# EAGLE design TouchPanelPrototype (EAGLE 6.3)
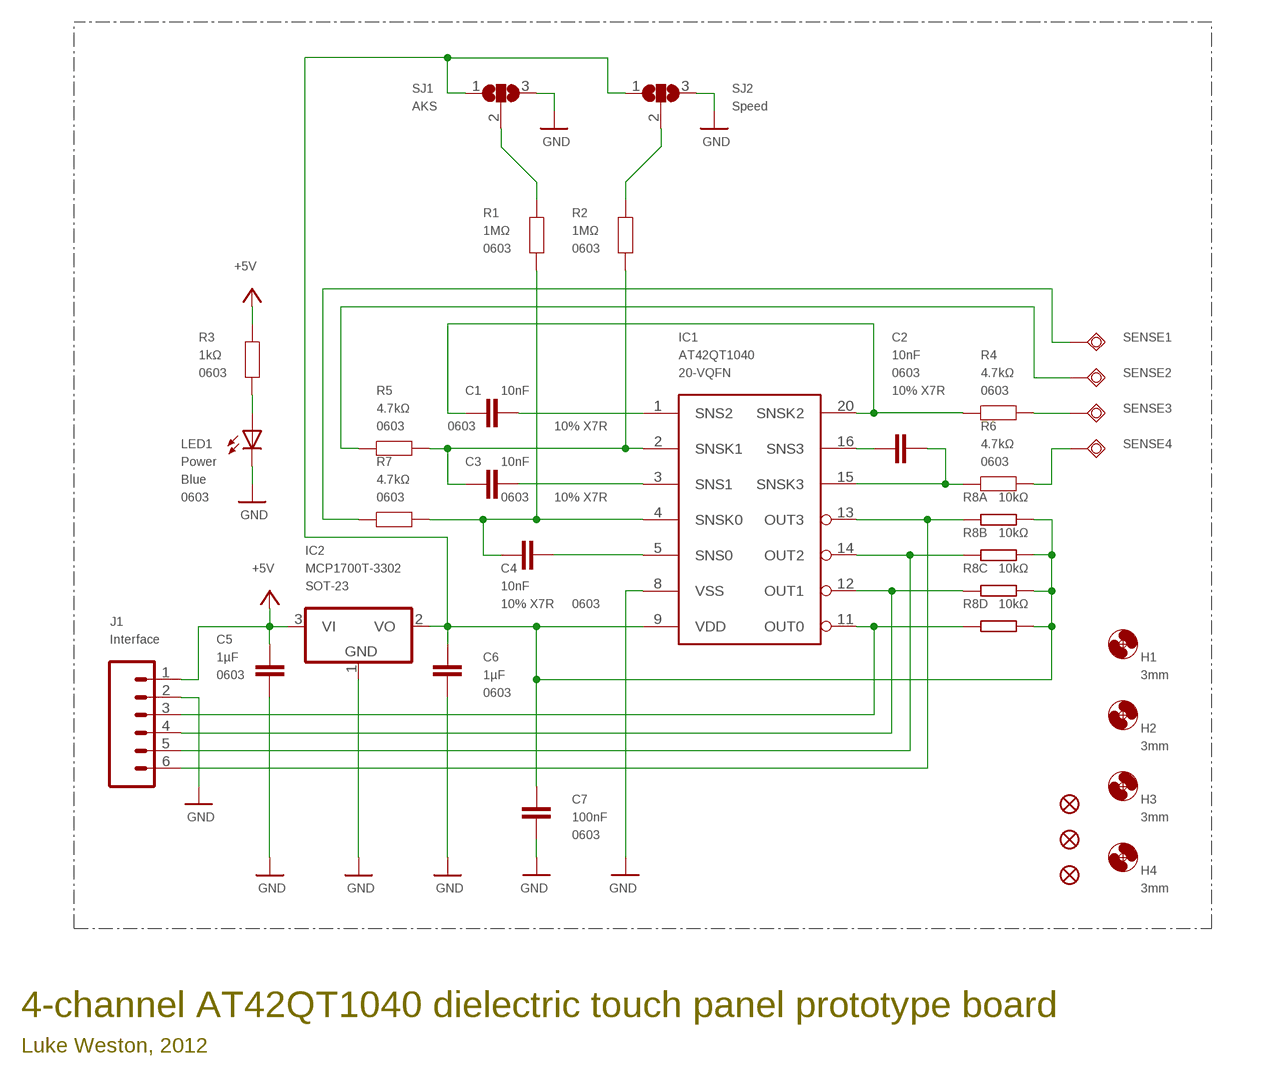
[diagram p0: schematic, sheet 1, part 1 of 2]
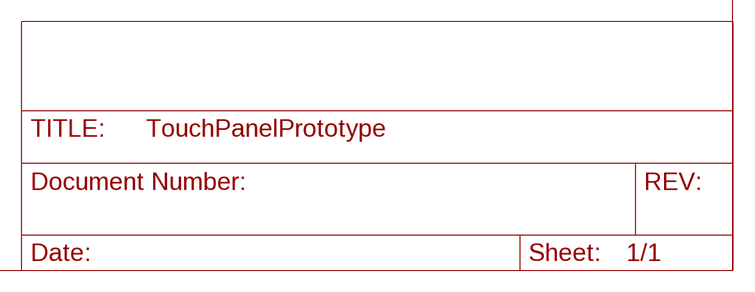
[diagram p1: schematic, sheet 1, part 2 of 2]

## Parts
C1  10nF  CAP0603  [0603]
C2  10nF  CAP0603  [0603]
C3  10nF  CAP0603  [0603]
C4  10nF  CAP0603  [0603]
C5  1µF  CAP0603  [0603]
C6  1µF  CAP0603  [0603]
C7  100nF  CAP0603  [0603]
H1  3mm  MOUNT-HOLE3.0  [3,0]
H2  3mm  MOUNT-HOLE3.0  [3,0]
H3  3mm  MOUNT-HOLE3.0  [3,0]
H4  3mm  MOUNT-HOLE3.0  [3,0]
IC1  AT42QT1040  [QFN/MLF20]
IC2  MCP1700T-3302  MCP1703CB  [SOT23]
J1  Interface  M06SIP  [1X06]
JP1  FIDUCIAL1X2  [FIDUCIAL-1X2]
JP2  FIDUCIAL1X2  [FIDUCIAL-1X2]
JP3  FIDUCIAL1X2  [FIDUCIAL-1X2]
LED1  Power  LED0603  [LED-0603]
R1  1MΩ  RESISTOR0603  [0603]
R2  1MΩ  RESISTOR0603  [0603]
R3  1kΩ  RESISTOR0603  [0603]
R4  4.7kΩ  RESISTOR0603  [0603]
R5  4.7kΩ  RESISTOR0603  [0603]
R6  4.7kΩ  RESISTOR0603  [0603]
R7  4.7kΩ  RESISTOR0603  [0603]
R8  10kΩ  CAY16  [CAY16]
SENSE1  TPSQTP20R  [TP20R]
SENSE2  TPSQTP20R  [TP20R]
SENSE3  TPSQTP20R  [TP20R]
SENSE4  TPSQTP20R  [TP20R]
SJ1  AKS  SJ2W  [SJ_2]
SJ2  Speed  SJ2W  [SJ_2]

## Nets
+5V: C5.2 IC2.3(VI) J1.1 R3.1
GND: C5.1 C6.1 C7.1 IC1.8(VSS) IC2.1(GND) J1.2 LED1.C SJ1.3 SJ2.3
N$1: LED1.A R3.2
N$3: C4.1 IC1.5(SNS0)
N$14: C2.2 IC1.16(SNS3)
N$15: C3.1 IC1.3(SNS1)
N$16: C1.1 IC1.1(SNS2)
N$17: C1.2 IC1.20(SNSK2) R4.2
N$19: C3.2 IC1.2(SNSK1) R2.2 R5.1
N$20: C4.2 IC1.4(SNSK0) R1.2 R7.1
N$25: C2.1 IC1.15(SNSK3) R6.2
N$30: R5.2 SENSE2.TP
N$31: R4.1 SENSE3.TP
N$32: R6.1 SENSE4.TP
N$34: R7.2 SENSE1.TP
N$40: R1.1 SJ1.2
N$41: R2.1 SJ2.2
N$43: C6.2 C7.2 IC1.9(VDD) IC2.2(VO) R8.1 R8.2 R8.3 R8.4 SJ1.1 SJ2.1
TOUCH1: IC1.11(OUT0) J1.3 R8.5
TOUCH2: IC1.12(OUT1) J1.4 R8.6
TOUCH3: IC1.14(OUT2) J1.5 R8.7
TOUCH4: IC1.13(OUT3) J1.6 R8.8

## Notes on the sheet
- 4-channel AT42QT1040 dielectric touch panel prototype board
- Luke Weston, 2012

## Library data of the parts
C1-C4 = freetronics-master-v1:CAP: Capacitor Standard 0603 ceramic capacitor, and 0.1" leaded capacitor.; INFO: 10% X7R; PACKAGE: 0603
C5-C7 = freetronics-master-v1:CAP: Capacitor Standard 0603 ceramic capacitor, and 0.1" leaded capacitor.; PACKAGE: 0603
H1-H4 = holes:MOUNT-HOLE: MOUNTING HOLE with drill center marker
IC1 = at42qt1040:AT42QT1040: QTouch 4-key Sensor IC ATMEL 20 pin 3x3 mm VQFN RoHS compliant AUTOR CICHOCKI ZBIGNIEW E-mile ontario4@wp.pl; PACKAGE: 20-VQFN
IC2 = linear:MCP1703: 250 mA, 16V, Low Quiescent Current LDO Regulator Source: http://ww1.microchip.com/downloads/en/DeviceDoc/22049b.pdf; PACKAGE: SOT-23
J1 = freetronics-master-v1:M06: Header 6 Standard 6-pin 0.1" header. Use with straight break away headers (SKU : PRT-00116), right angle break away headers (PRT-00553), swiss pins (PRT-00743), machine pins (PRT-00117), and female headers (PRT-00115). Molex polarized connector foot print use with SKU : PRT-08094 with associated crimp pins and housings. NOTES ON THE VARIANTS LOCK and LOCK_LONGPADS... This footprint was designed to help hold the alignment of a through-hole component (i.e. 6-pin header) while soldering it into place. You may notice that each hole has been shifted either up or down by 0.005 of an inch from it's more standard position (which is a perfectly straight line). This slight alteration caused the pins (the squares in the middle) to touch the edges of the holes. Because they are alternating, it causes a "brace" to hold the component in place. 0.005 has proven to be the perfect amount of "off-center" position when using our standard breakaway headers. Although looks a little odd when you look at the bare footprint, once you have a header in there, the alteration is very hard to notice. Also, if you push a header all the way into place, it is covered up entirely on the bottom side. This idea of altering the position of holes to aid alignment will be further integrated into the Sparkfun Library for other footprints. It can help hold any component with 3 or more connection pins.
JP1-JP3 = SparkFun:FIDUCIAL: Fiducial Alignment Points Various fiducial points for machine vision alignment.
LED1 = freetronics-master-v1:LED: LEDs Standard schematic elements and footprints for 5mm, 3mm, 1206, and 0603 sized LEDs. 5mm - Spark Fun Electronics SKU : COM-00529 (and others); COLOUR: Blue; PACKAGE: 0603
R1-R7 = freetronics-master-v1:RESISTOR: Resistor Basic schematic elements and footprints for 0603, 1206, and PTH 1/10th watt (small) resistors.; PACKAGE: 0603
R8 = freetronics-luke:CAY16
SENSE1-SENSE4 = testpad:TPSQ: Test pad
SJ1 SJ2 = jumper:SJ2W: SMD solder JUMPER

## Net classes
0 default: width 0.152 mm, drill 0.241 mm, clearance 0.152 mm

## Board
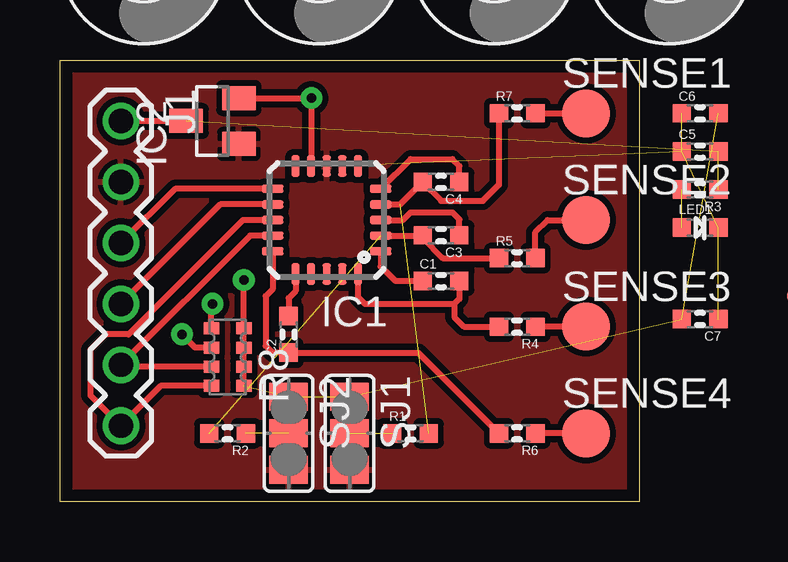
[diagram p2: board, top side]
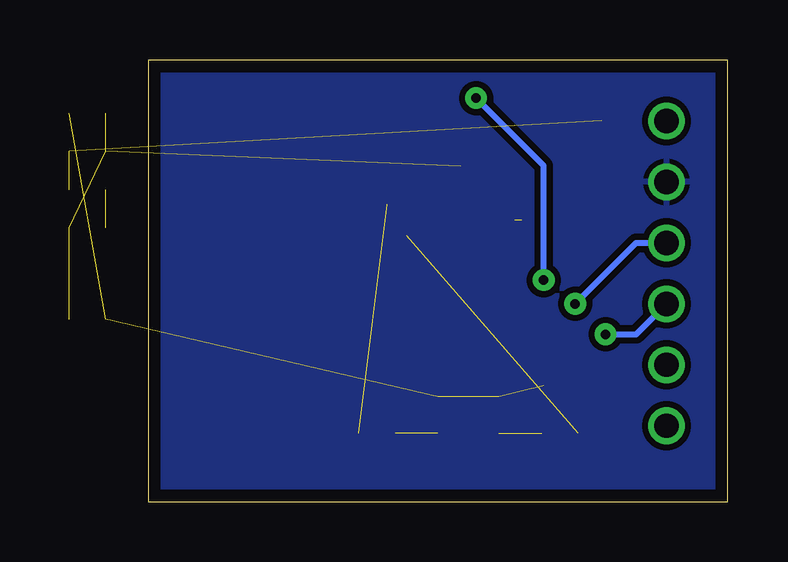
[diagram p3: board, bottom side, seen from below]

Size 24.13 x 18.42 mm. Coordinates in mm from the lower left corner, seen from the top.
Outline: 0,18.42 24.13,18.42 24.13,0 0,0 0,18.42
Copper layers (1*16): Top 0.035mm / dielectric 1.5mm / Bottom 0.035mm
Design rules "default": minimum track width 8mil, minimum drill 0.4mm, track to track 8mil, track to pad 8mil, pad to pad 8mil, via to via 8mil, smd to smd 8mil, copper to edge 20mil, drill to drill 8mil, minimum pad ring 8mil, minimum via ring 10mil, stop-mask expansion 3mil, vias tented up to drill 14mil, thermal gap 8mil

### Footprints (pad centres in the part's own frame; a part is rotated, then mirrored left to right if it is on the bottom)
0603 = smd 0.762 x 0.762: 1 -0.762,0; 2 0.762,0
3,0 = hole 3: 0,0
QFN/MLF20 = smd 0.9 x 0.35: 1 -2.25,1.3; 2 -2.25,0.65; 3 -2.25,0; 4 -2.25,-0.65; 5 -2.25,-1.3; 11 2.25,-1.3; 12 2.25,-0.65; 13 2.25,0; 14 2.25,0.65; 15 2.25,1.3 | smd 0.35 x 0.9: 6 -1.3,-2.25; 7 -0.65,-2.25; 8 0,-2.25; 9 0.65,-2.25; 10 1.3,-2.25; 16 1.3,2.25; 17 0.65,2.25; 18 0,2.25; 19 -0.65,2.25; 20 -1.3,2.25
SOT23 = smd 1 x 1.4: 1 -0.95,-1.1; 2 0.95,-1.1; 3 0,1.1
1X06 = drill 1.016: 1 0,0; 2 2.54,0; 3 5.08,0; 4 7.62,0; 5 10.16,0; 6 12.7,0
FIDUCIAL-1X2 = smd 1 x 1: 1 0,0
LED-0603 = smd 0.762 x 0.762: A -0.762,0; C 0.762,0
CAY16 = smd 0.5 x 0.65: 1 -1.2,-0.675; 2 -0.4,-0.675; 3 0.4,-0.675; 4 1.2,-0.675; 5 1.2,0.675; 6 0.4,0.675; 7 -0.4,0.675; 8 -1.2,0.675
TP20R = smd 2 x 2: TP 0,0
SJ_2 = smd 1.168 x 1.6: 1 -1.524,0; 2 0,0; 3 1.524,0

### Placement (x,y rotation side)
C1  15.87,9.21 0 top
C2  9.52,6.99 90 top
C3  15.87,11.11 180 top
C4  15.87,13.33 180 top
C5  26.67,14.6 0 top
C6  26.67,16.19 0 top
C7  26.67,7.62 180 top
H1  25.4,22.54 90 top  (outside the outline)
H2  10.79,22.54 90 top  (outside the outline)
H3  18.1,22.54 90 top  (outside the outline)
H4  3.49,22.54 90 top  (outside the outline)
IC1  11.11,11.75 180 top
IC2  6.35,15.87 90 top
J1  2.54,15.87 270 top
JP1  30.8,8.57 0 top  (outside the outline)
JP2  31.43,10.79 0 top  (outside the outline)
JP3  31.12,13.02 0 top  (outside the outline)
LED1  26.67,11.43 0 top
R1  14.6,2.86 0 top
R2  6.99,2.86 180 top
R3  26.67,13.02 180 top
R4  19.05,7.3 180 top
R5  19.05,10.16 0 top
R6  19.05,2.86 180 top
R7  19.05,16.19 0 top
R8  6.99,6.03 90 top
SENSE1  21.91,16.19 0 top
SENSE2  21.91,11.75 0 top
SENSE3  21.91,7.3 0 top
SENSE4  21.91,2.86 0 top
SJ1  12.06,2.86 270 top
SJ2  9.52,2.86 270 top

### Tracks (layer width: path | path; a pad name or v marks a point on that pad's centre or on a via)
+5V  (2 unrouted)
  Top 0.254: J1.1 IC2.3
GND  (4 unrouted)
  pour Top (isolate 0.254): -0.32,-0.32 24.45,-0.32 24.45,18.73 -0.32,18.73
  pour Bottom (isolate 0.254): -0.32,-0.32 24.45,-0.32 24.45,18.73 -0.32,18.73
N$1  (1 unrouted)
N$3
  Top 0.254: IC1.5 14.6,14.29 16.35,14.29 16.64,14 C4.1
N$14
  Top 0.254: IC1.16 9.81,8.78 9.52,8.49 C2.2
N$15
  Top 0.254: IC1.3 14.29,11.75 14.6,12.07 16.35,12.07 16.64,11.78 C3.1
N$16
  Top 0.254: IC1.1 13.36,9.82 13.97,9.21 C1.1
N$17
  Top 0.254: IC1.20 12.41,8.54 12.7,8.25 16.43,8.25 | C1.2 16.64,8.46 16.43,8.25 | 16.43,8.25 16.43,7.7 16.83,7.3 R4.2
N$19  (1 unrouted)
  Top 0.254: IC1.2 15.1,11.1 C3.2 15.11,11 15.95,10.16 R5.1
N$20  (1 unrouted)
  Top 0.254: IC1.4 14.18,12.4 C4.2 15.11,13.3 15.87,12.54 17.62,12.54 18.29,13.21 R7.1
N$25
  Top 0.254: IC1.15 8.86,8.86 8.57,8.57 8.57,6.51 8.86,6.22 C2.1 14.92,6.22 R6.2
N$30
  Top 0.254: R5.2 19.81,11.24 20.32,11.75 SENSE2.TP
N$31
  Top 0.254: SENSE3.TP R4.1
N$32
  Top 0.254: SENSE4.TP R6.1
N$34
  Top 0.254: R7.2 SENSE1.TP
N$40  (1 unrouted)
N$41  (1 unrouted)
N$43  (via drill 0.4)  (4 unrouted)
  Top 0.254: IC2.2 10.16,16.82 v10.48,16.83 10.48,14.01 IC1.9 | v7.66,9.25 R8.4 R8.3 R8.2 R8.1
  Bottom 0.254: v7.66,9.25 7.66,14.01 v10.48,16.83
TOUCH1  (via drill 0.4)
  Top 0.254: IC1.11 4.79,13.05 J1.3 | R8.5 6.31,8.22 v6.35,8.25
  Bottom 0.254: v6.35,8.25 3.81,10.8 J1.3
TOUCH2  (via drill 0.4)
  Top 0.254: IC1.12 6.68,12.4 J1.4 | R8.6 5.63,6.43 v5.08,6.99
  Bottom 0.254: v5.08,6.99 3.81,6.99 J1.4
TOUCH3
  Top 0.254: IC1.14 7.92,11.1 J1.5 2.62,5.63 R8.7
TOUCH4  (1 unrouted)
  Top 0.254: 8.57,11.75 7.62,11.75 2.86,6.99 1.91,6.99 1.27,6.35 1.27,4.45 J1.6 4.2,4.83 R8.8